# Altium schematic sheet MCU.SchDoc
size A4; SheetNumber: 3; SheetTotal: 4
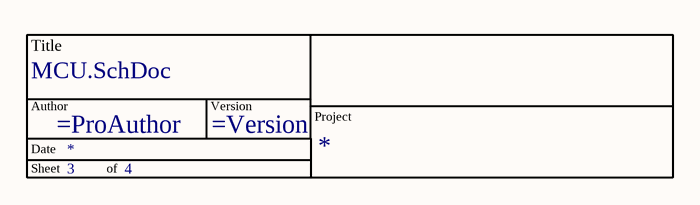
[diagram p0: MCU.SchDoc]

## Parts
?  Title_Block  (value not drawn)

## Notes on the sheet
- (in symbol Title_Block) Title; Author; Version; Project; Date; Sheet; of